# Altium schematic sheet Display.SchDoc
size 393 x 281 mm; DocumentNumber: 7; SheetNumber: 7; SheetTotal: 7; Format: A3; Abteilung: Entwicklung
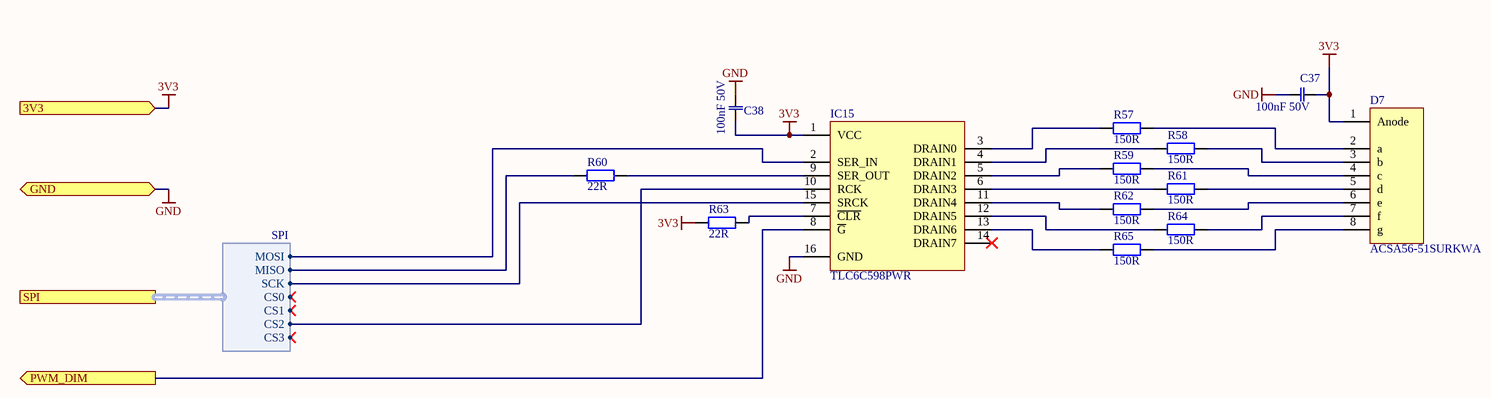
[diagram p0: Display.SchDoc]

## Parts
C37  100nF 50V  [CAPC1005N]
C38  100nF 50V  [CAPC1005N]
D7  ACSA56-51SURKWA  [ACSA56-51SURKWA]
IC15  TLC6C598PWR  [TSSOP65P640X120-16N]
R57  150R  [RESC1005L]
R58  150R  [RESC1005L]
R59  150R  [RESC1005L]
R60  22R  [RESC1005L]
R61  150R  [RESC1005L]
R62  150R  [RESC1005L]
R63  22R  [RESC1005L]
R64  150R  [RESC1005L]
R65  150R  [RESC1005L]

## Ports
3V3 (in), GND (bidir), PWM_DIM (out), SPI (harness SPI)

## Harnesses
SPI: CS0, MISO, MOSI, SCK, CS1, CS2, CS3

## Nets
3V3: C37.1 C38.1 D7.1(Anode) IC15.1(VCC) R63.1 ; port 3V3
GND: C37.2 C38.2 IC15.16(GND) ; port GND
PWM_DIM: IC15.8(~{G}) ; port PWM_DIM
NetD7_2: D7.2(a) R57.2
NetD7_3: D7.3(b) R58.2
NetD7_4: D7.4(c) R59.2
NetD7_5: D7.5(d) R61.2
NetD7_6: D7.6(e) R62.2
NetD7_7: D7.7(f) R64.2
NetD7_8: D7.8(g) R65.2
NetIC15_2: IC15.2(SER_IN) ; port SPI.MOSI
NetIC15_3: IC15.3(DRAIN0) R57.1
NetIC15_4: IC15.4(DRAIN1) R58.1
NetIC15_5: IC15.5(DRAIN2) R59.1
NetIC15_6: IC15.6(DRAIN3) R61.1
NetIC15_7: IC15.7(~{CLR}) R63.2
NetIC15_9: IC15.9(SER_OUT) R60.2
NetIC15_10: IC15.10(RCK) ; port SPI.CS2
NetIC15_11: IC15.11(DRAIN4) R62.1
NetIC15_12: IC15.12(DRAIN5) R64.1
NetIC15_13: IC15.13(DRAIN6) R65.1
NetIC15_15: IC15.15(SRCK) ; port SPI.SCK
NetR60_1: R60.1 ; port SPI.MISO

Not connected (* = marked no-connect by the designer): IC15 14(DRAIN7)*

## Notes on the sheet
- Date/Datum
- Name
- Identification No./Modell Nr.
- Classification/
- Checked
- Approved
- Issued
- Designation/Benennung
- Revision-Character/Versions-Buchstabe
- Verwendungsbereich
- Drawn/Hersteller
- Dept./Abt.
- iMAR Navigation GmbH
- Rev./Ver.
- Drawing No./Zeichnungsnummer
- Sheet/Blatt
- /
- Im Reihersbruch 3
- D-66386 St. Ingbert
- www.imar.de <http://www.imar.de>
- Filename/Dateiname
- Format
- A3

## Library data of the parts
C37 C38 = CMP-002-0216-3: 100nF  50V  Ceramic  0402  10%  X7R; Manufacturer_PN: unspecified; Failure_in_Time_notes: 55°C, 90% Upper Confidence Level, Daten von Wuerth verwendet; Failure_in_Time_value: 0,000123; Temperature_min: -55°C; iMAR_PN: 00001-08791-0000; Temperature_max: 125°C; iComment: 100nF 50V; Capacitor_Type: Ceramic; Voltage: 50V; Mount: SMD; Case/Package: 0402; Manufacturer: unspecified; Kategorie: X7R; Tolerance: 10%; RoHS: Yes; Value: 100nF
D7 = CMP-ROOT-00525-1: Smart/Normal 7 Seg Numeric LED Display; pin to pad: 1>3+8 2>7 3>6 5>2 6>1 7>9 8>5+10; Manufacturer: Kingbright; Power: 75mW; Temperature_min: -40°C; Uf: 1.95V; Color: Red; Temperature_max: 85°C; If: 20mA; Ub: 5V; 3TG_Conformity: Yes; Manufacturer_PN: ACSA56-51SURKWA; Type: LED; Case/Package: 7 Segment; Mount: SMD; RoHS: Yes; Pins: 10
IC15 = CMP-006-0135-1: LED Driver, 8-Segment, PDSO16; Manufacturer: TEXAS INSTRUMENTS; iMAR_PN: tbd; Temperature_max: 105°C; 3TG_Conformity: Yes; Temperature_min: -40°C; Mount: SMD; Case/Package: TSSOP-16; Pins: 16; Manufacturer_PN: TLC6C598PWR; RoHS: Yes
R57-R59 R61 R62 R64 R65 = CMP-001-0226-23: 150R  0402  62mW  1%  100ppm  50V; Manufacturer: unspecified; Failure_in_Time_notes: 55°C, 60% Upper Confidence Level; Daten von Vishay verwendet; iMAR_PN: 00001-08393-0000; Value: 150; Temperature_max: 125°C; TK: ±100; Failure_in_Time_value: 0,0001; Temperature_min: -40°C; Power: 62mW; Voltage: 50V; Tolerance: 1%; RoHS: Yes; Case/Package: 0402; Manufacturer_PN: unspecified; iComment: 150; Mount: SMD
R60 R63 = CMP-001-0206-25: 22R  0402  62mW  1%  100ppm  50V; Manufacturer: unspecified; iComment: 22; Temperature_min: -40°C; Failure_in_Time_value: 0,0001; TK: ±100; Failure_in_Time_notes: 55°C, 60% Upper Confidence Level; Daten von Vishay verwendet; Temperature_max: 125°C; Value: 22; iMAR_PN: 00001-07283-0000; RoHS: Yes; Power: 62mW; Manufacturer_PN: unspecified; Case/Package: 0402; Tolerance: 1%; Voltage: 50V; Mount: SMD